# Altium schematic sheet E-27 Line Sensor.SchDoc: E-27 Line Sensor
size B; DrawnBy: Jeremie Boulianne; Organization: Synthiam Inc.; Address1: Unit 10, 6120 - 11 St. SE; Address2: Calgary, AB; Address3: T2H 2L7; Address4: Canada; Revision: 0
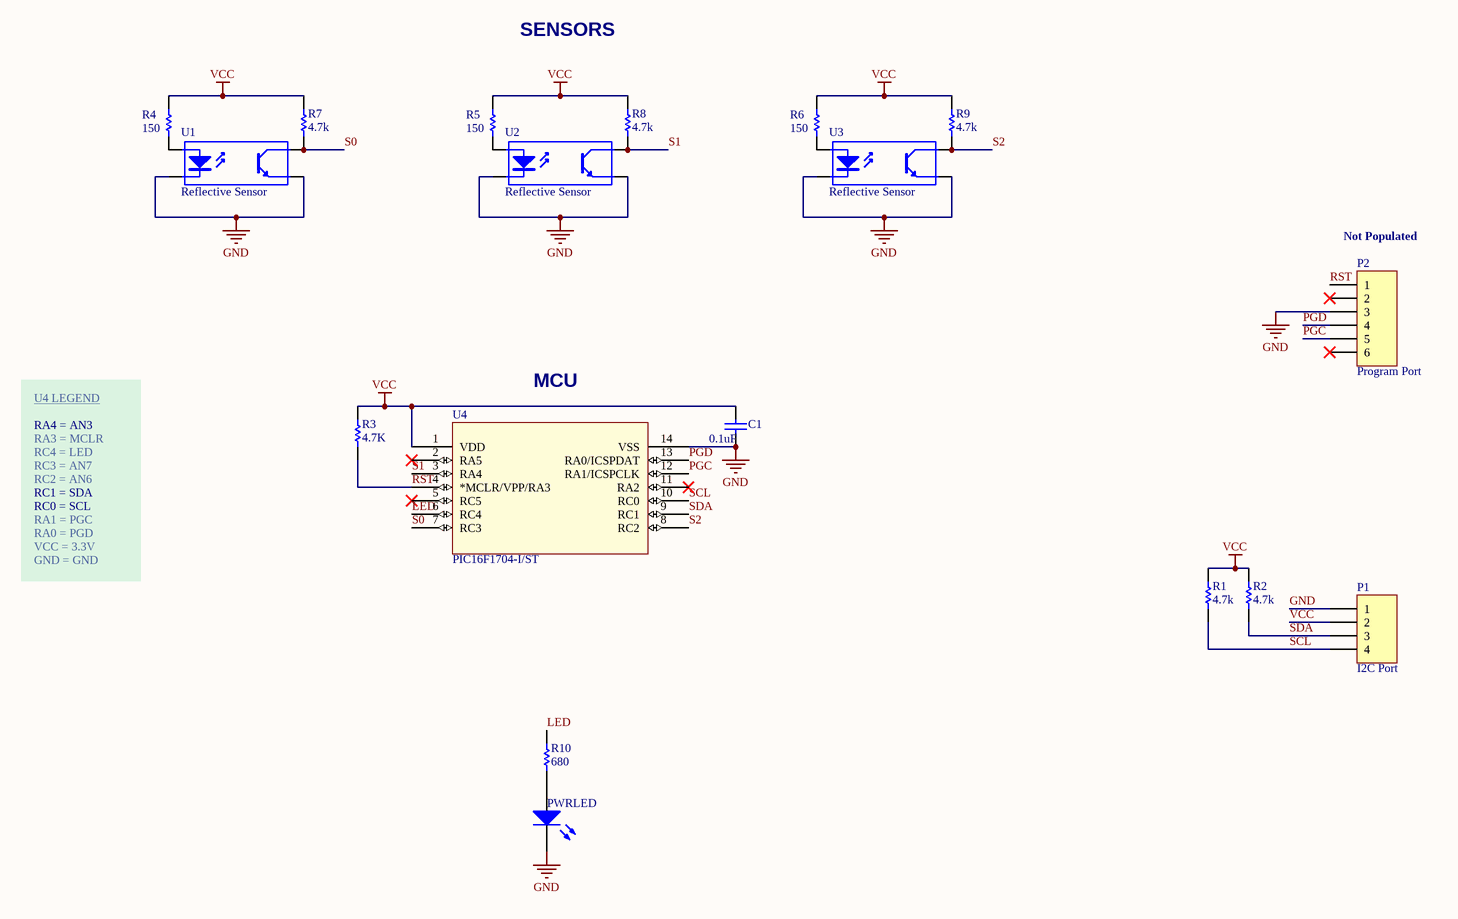
[diagram p0: E-27 Line Sensor.SchDoc]

## Parts
C1  value 0.1uF  [0805 TIGHT]  (hidden comment: 18pF)
P1  I2C Port  [JST-PH 4-pin SMD]
P2  Program Port  [Mini Prog header]
PWRLED  LED2  [0805 LED - TIGHT]  (value not drawn)
R1  value 4.7k  [0805 TIGHT]  (hidden comment: 10kohm)
R2  value 4.7k  [0805 TIGHT]  (hidden comment: 10kohm)
R3  value 4.7K  [0805 TIGHT]  (hidden comment: Res1)
R4  value 150  [0805 TIGHT]  (hidden comment: 10kohm)
R5  value 150  [0805 TIGHT]  (hidden comment: 10kohm)
R6  value 150  [0805 TIGHT]  (hidden comment: 10kohm)
R7  value 4.7k  [0805 TIGHT]  (hidden comment: 10kohm)
R8  value 4.7k  [0805 TIGHT]  (hidden comment: 10kohm)
R9  value 4.7k  [0805 TIGHT]  (hidden comment: 10kohm)
R10  value 680  [0805 TIGHT]  (hidden comment: Res1)
U1  Reflective Sensor  [TCRT5000]
U2  Reflective Sensor  [TCRT5000]
U3  Reflective Sensor  [TCRT5000]
U4  PIC16F1704-I/ST  [TSSOP14]

## Nets
GND: C1.1 P1.1 P2.3 PWRLED.2(K) U1.2(K) U1.3(E) U2.2(K) U2.3(E) U3.2(K) U3.3(E) U4.14(VSS)
VCC: C1.2 P1.2 R1.1 R2.1 R3.2 R4.2 R5.1 R6.2 R7.1 R8.1 R9.1 U4.1(VDD)
LED: R10.2 U4.6(RC4)
PGC: P2.5 U4.12(RA1/ICSPCLK)
PGD: P2.4 U4.13(RA0/ICSPDAT)
RST: P2.1 R3.1 U4.4(*MCLR/VPP/RA3)
S0: R7.2 U1.4(C) U4.7(RC3)
S1: R8.2 U2.4(C) U4.3(RA4)
S2: R9.2 U3.4(C) U4.8(RC2)
SCL: P1.4 R1.2 U4.10(RC0)
SDA: P1.3 R2.2 U4.9(RC1)
NetPWRLED_1: PWRLED.1(A) R10.1
NetR4_1: R4.1 U1.1(A)
NetR5_2: R5.2 U2.1(A)
NetR6_1: R6.1 U3.1(A)

Not connected (* = marked no-connect by the designer): P2 2* 6*; U4 2(RA5)* 5(RC5)* 11(RA2)*

## Notes on the sheet
- SENSORS
- (near P2) Not Populated
- RA3 = MCLR
- U4 LEGEND
- RA4 = AN3
- MCU
- RC4 = LED
- RC3 = AN7
- RC2 = AN6
- RC1 = SDA
- RC0 = SCL
- RA1 = PGC
- RA0 = PGD
- VCC = 3.3V
- GND = GND
- Property of:
- Size:
- Date:
- B
- Drawn By:
- Time:
- Revision:
- Copyright © 2019 Synthiam Inc. All rights reserved.

## Library data of the parts
C1 = Cap: Capacitor; Published: 8-Jun-2000; LatestRevisionDate: 17-Jul-2002; LatestRevisionNote: Re-released for DXP Platform.; PackageReference: RAD-0.3; Publisher: Altium Limited
P1 = Header 4: Header, 4-Pin; LatestRevisionDate: 17-Jul-2002; LatestRevisionNote: Re-released for DXP Platform.; Publisher: Altium Limited
P2 = Header 6: Header, 6-Pin; LatestRevisionDate: 17-Jul-2002; LatestRevisionNote: Re-released for DXP Platform.; Publisher: Altium Limited
PWRLED = LED1: Typical RED GaAs LED; Published: 8-Jun-2000; LatestRevisionDate: 08-Jul-2005; LatestRevisionNote: Mech Layer 1 removed.; PackageReference: LED-1; Publisher: Altium Limited
R1-R10 = Res1: Resistor; Published: 8-Jun-2000; LatestRevisionDate: 17-Jul-2002; LatestRevisionNote: Re-released for DXP Platform.; PackageReference: AXIAL-0.3; Publisher: Altium Limited
U1-U3 = Optoisolator1: 4-Pin Phototransistor Optocoupler; Published: 24-Mar-1999; LatestRevisionDate: 04-Mar-2005; LatestRevisionNote: Sch pins 3 & 4 Swapped.; DatasheetVersion: Nov-2003; PackageReference: DIP-4; Publisher: Altium Limited
U4 = PIC16F1503